# Altium project A3010_Adelaide_8MB_IDE.PrjPcb
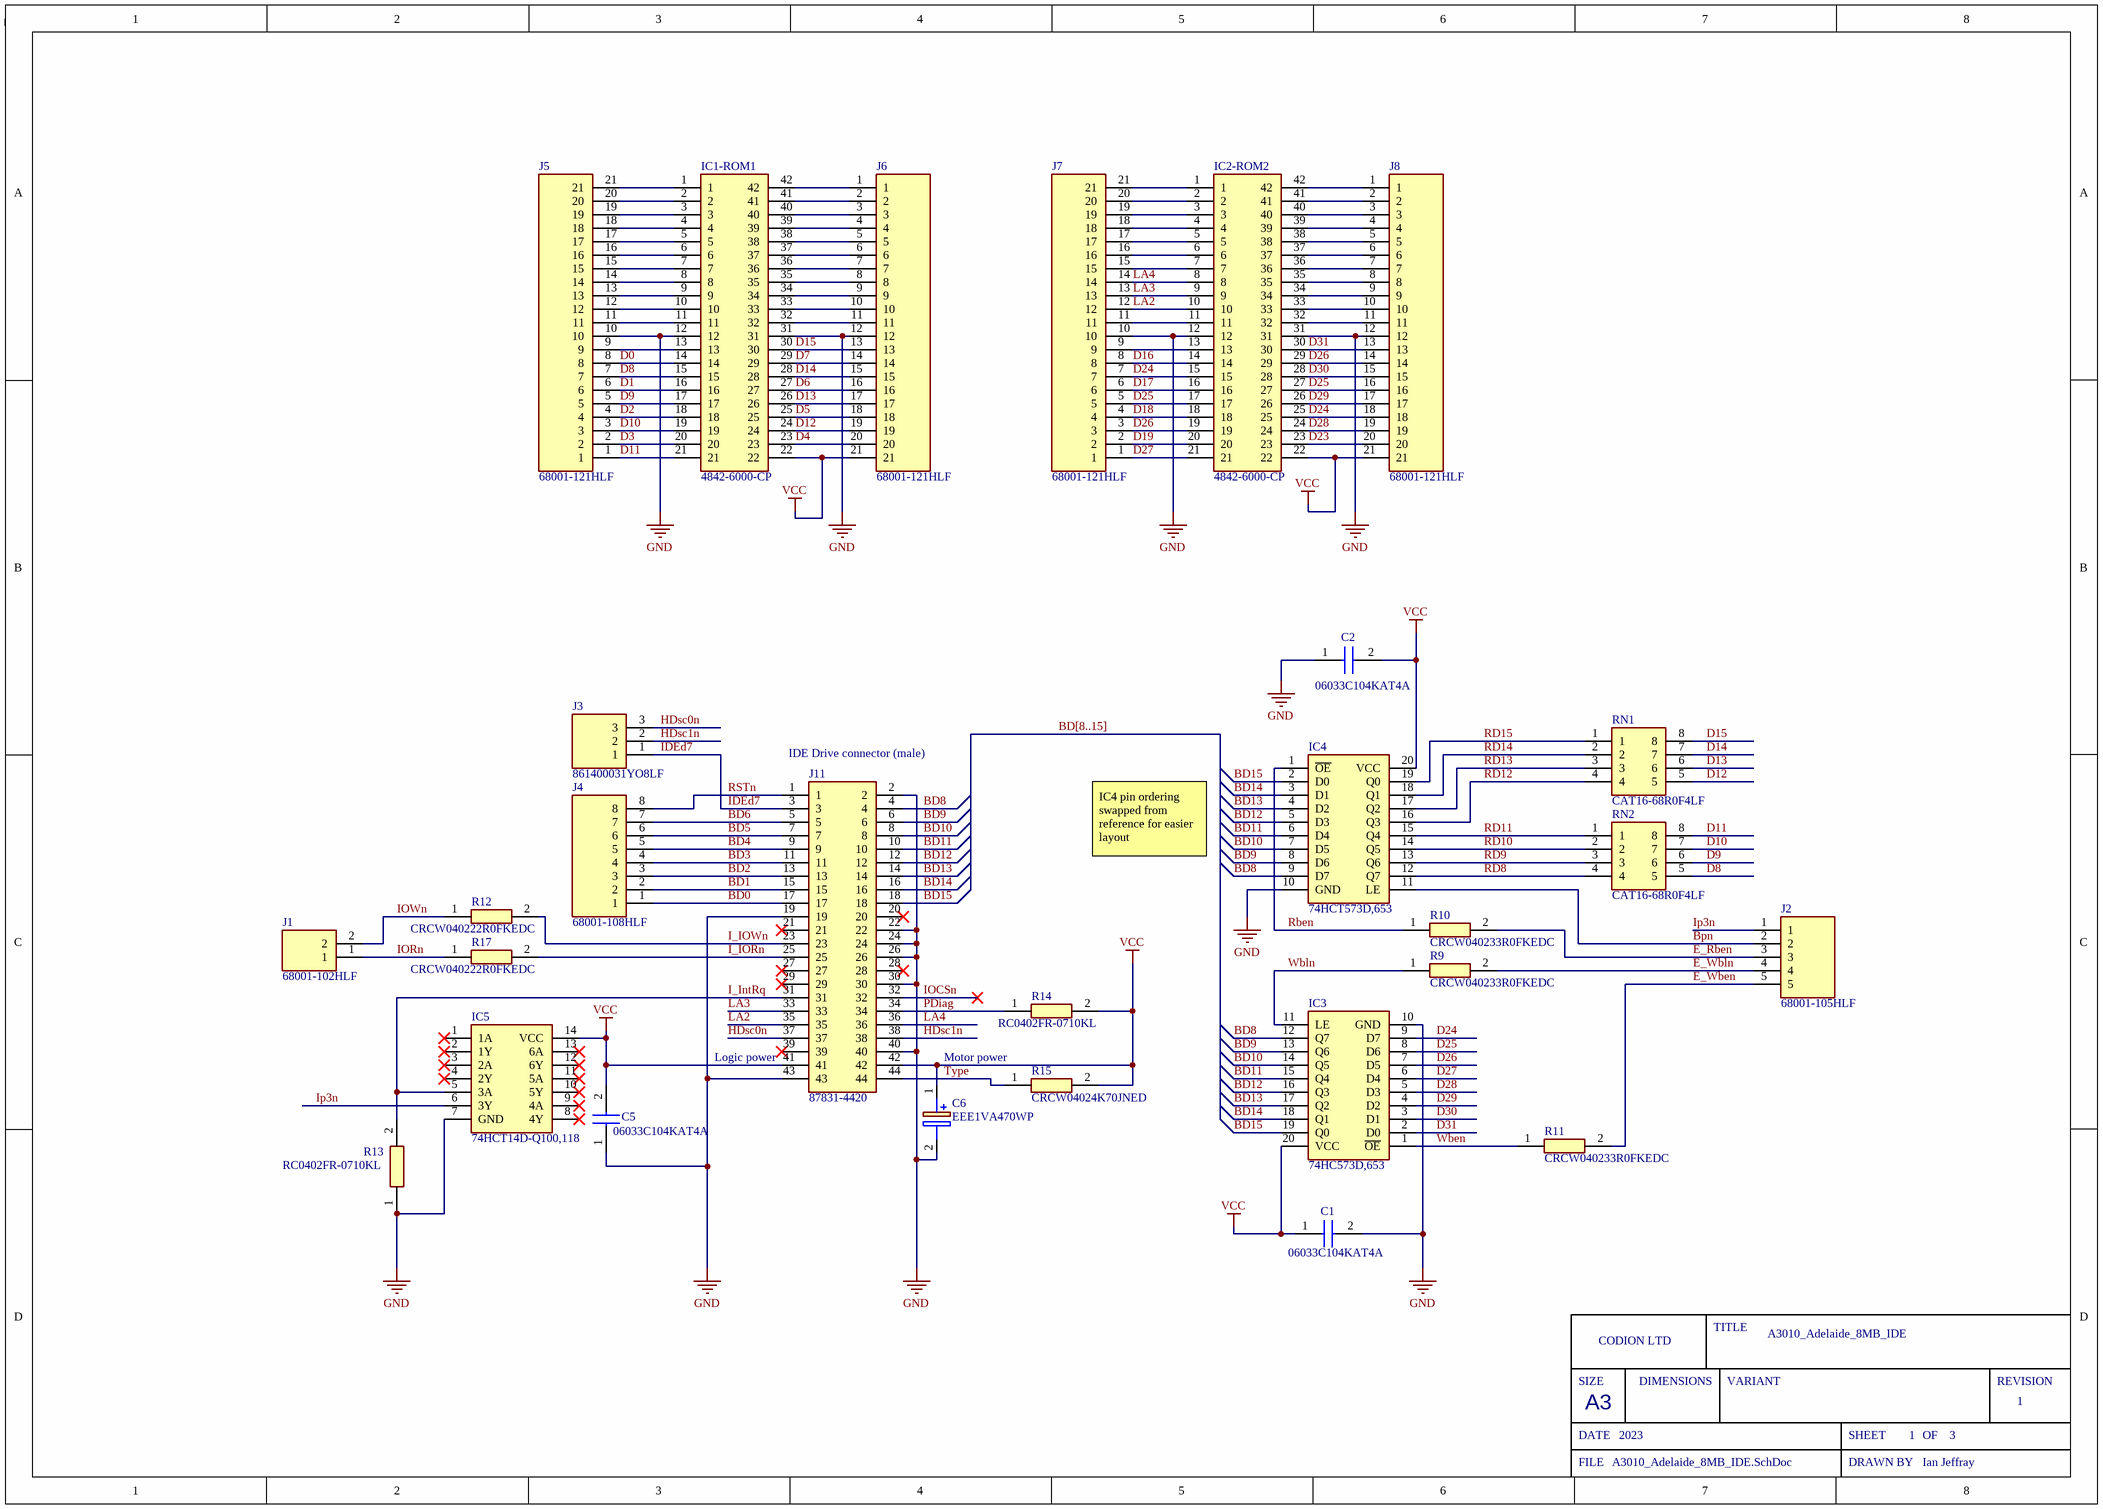
[diagram p0: A3010_Adelaide_8MB_IDE.SchDoc]
Sch_RevNo: 1; Sch_ReleaseDate: 2023; Project_TItle: A3010_Adelaide_8MB_IDE
3 sheets, 57 parts. Net scope: global (net labels, ports and power ports of the same name join across sheets).
Board file: A3010_Adelaide_8MB_IDE.PcbDoc
Sheets:
  A3010_Adelaide_8MB_IDE.SchDoc
  A3010_Adelaide_8MB_IDE_RAM.SchDoc
  A3010_Adelaide_8MB_IDE_RAM2.SchDoc

## Sheet A3010_Adelaide_8MB_IDE.SchDoc
size A3; SheetNumber: 1; SheetTotal: 3

### Parts
C1  06033C104KAT4A  [CAPC1608X90N]
C2  06033C104KAT4A  [CAPC1608X90N]
C5  06033C104KAT4A  [CAPC1608X90N]
C6  EEE1VA470WP  [EEE1AA101SP]
IC1-ROM1  4842-6000-CP  [48426000CP]
IC2-ROM2  4842-6000-CP  [48426000CP]
IC3  74HC573D,653  [SOIC127P1032X265-20N]
IC4  74HCT573D,653  [SOIC127P1032X265-20N]
IC5  74HCT14D-Q100,118  [SOIC127P600X175-14N]
J1  68001-102HLF  [HDRV2W67P0X254_1X2_508X241X858P]
J2  68001-105HLF  [HDRV5W90P0X254_1X5_1270X241X1143P]
J3  861400031YO8LF  [HDRV3W63P0X254_1X3_762X254X980P]
J4  68001-108HLF  [HDRV8W90P0X254_1X8_2032X241X1143P]
J5  68001-121HLF  [HDRV21W67P0X254_1X21_5334X241X858P]
J6  68001-121HLF  [HDRV21W67P0X254_1X21_5334X241X858P]
J7  68001-121HLF  [HDRV21W67P0X254_1X21_5334X241X858P]
J8  68001-121HLF  [HDRV21W67P0X254_1X21_5334X241X858P]
J11  87831-4420  [SHDR44W55P200_2X22_4665X630X640P]
R9  CRCW040233R0FKEDC  [RESC1005X35N]
R10  CRCW040233R0FKEDC  [RESC1005X35N]
R11  CRCW040233R0FKEDC  [RESC1005X35N]
R12  CRCW040222R0FKEDC  [RESC1005X35N]
R13  RC0402FR-0710KL  [RESC1005X40N]
R14  RC0402FR-0710KL  [RESC1005X40N]
R15  CRCW04024K70JNED  [RESC1005X40N]
R17  CRCW040222R0FKEDC  [RESC1005X35N]
RN1  CAT16-68R0F4LF  [CAT1668R0F4LF]
RN2  CAT16-68R0F4LF  [CAT1668R0F4LF]

### Nets
GND: C1.2 C2.1 C5.1 C6.2(-) IC1-ROM1.12 IC1-ROM1.31 IC2-ROM2.12 IC2-ROM2.31 IC3.10(GND) IC4.10(GND) IC5.7(GND) J5.10 J6.12 J7.10 J8.12 J11.2 J11.19 J11.22 J11.24 J11.26 J11.30 J11.40 J11.43 R13.1
VCC: C1.1 C2.2 C5.2 C6.1(+) IC1-ROM1.22 IC2-ROM2.22 IC3.20(VCC) IC4.20(VCC) IC5.14(VCC) J6.21 J8.21 J11.41 J11.42 R14.2 R15.2
BD0: J4.1 J11.17
BD1: J4.2 J11.15
BD2: J4.3 J11.13
BD3: J4.4 J11.11
BD4: J4.5 J11.9
BD5: J4.6 J11.7
BD6: J4.7 J11.5
BD8: IC3.12(Q7) IC4.9(D7) J11.4
BD9: IC3.13(Q6) IC4.8(D6) J11.6
BD10: IC3.14(Q5) IC4.7(D5) J11.8
BD11: IC3.15(Q4) IC4.6(D4) J11.10
BD12: IC3.16(Q3) IC4.5(D3) J11.12
BD13: IC3.17(Q2) IC4.4(D2) J11.14
BD14: IC3.18(Q1) IC4.3(D1) J11.16
BD15: IC3.19(Q0) IC4.2(D0) J11.18
Bpn: IC4.11(LE) J2.2
D0: IC1-ROM1.14 J5.8
D1: IC1-ROM1.16 J5.6
D2: IC1-ROM1.18 J5.4
D3: IC1-ROM1.20 J5.2
D4: IC1-ROM1.23 J6.20
D5: IC1-ROM1.25 J6.18
D6: IC1-ROM1.27 J6.16
D7: IC1-ROM1.29 J6.14
D8: IC1-ROM1.15 J5.7 RN2.5
D9: IC1-ROM1.17 J5.5 RN2.6
D10: IC1-ROM1.19 J5.3 RN2.7
D11: IC1-ROM1.21 J5.1 RN2.8
D12: IC1-ROM1.24 J6.19 RN1.5
D13: IC1-ROM1.26 J6.17 RN1.6
D14: IC1-ROM1.28 J6.15 RN1.7
D15: IC1-ROM1.30 J6.13 RN1.8
D16: IC2-ROM2.14 J7.8
D17: IC2-ROM2.16 J7.6
D18: IC2-ROM2.18 J7.4
D19: IC2-ROM2.20 J7.2
D23: IC2-ROM2.23 J8.20
D24: IC2-ROM2.15 IC2-ROM2.25 IC3.9(D7) J7.7 J8.18
D25: IC2-ROM2.17 IC2-ROM2.27 IC3.8(D6) J7.5 J8.16
D26: IC2-ROM2.19 IC2-ROM2.29 IC3.7(D5) J7.3 J8.14
D27: IC2-ROM2.21 IC3.6(D4) J7.1
D28: IC2-ROM2.24 IC3.5(D3) J8.19
D29: IC2-ROM2.26 IC3.4(D2) J8.17
D30: IC2-ROM2.28 IC3.3(D1) J8.15
D31: IC2-ROM2.30 IC3.2(D0) J8.13
E_Rben: J2.3 R10.2
E_Wben: J2.5 R11.2
E_Wbln: J2.4 R9.2
HDsc0n: J3.3 J11.37
HDsc1n: J3.2 J11.38
I_IntRq: IC5.5(3A) J11.31 R13.2
I_IORn: J11.25 R17.2
I_IOWn: J11.23 R12.2
IDEd7: J3.1 J11.3
IOCSn: J11.32
IORn: J1.1 R17.1
IOWn: J1.2 R12.1
Ip3n: IC5.6(3Y) J2.1
LA2: IC2-ROM2.10 J7.12 J11.35
LA3: IC2-ROM2.9 J7.13 J11.33
LA4: IC2-ROM2.8 J7.14 J11.36
PDiag: J11.34 R14.1
Rben: IC4.1(~{OE}) R10.1
RD8: IC4.12(Q7) RN2.4
RD9: IC4.13(Q6) RN2.3
RD10: IC4.14(Q5) RN2.2
RD11: IC4.15(Q4) RN2.1
RD12: IC4.16(Q3) RN1.4
RD13: IC4.17(Q2) RN1.3
RD14: IC4.18(Q1) RN1.2
RD15: IC4.19(Q0) RN1.1
RSTn: J4.8 J11.1
Type: J11.44 R15.1
Wben: IC3.1(~{OE}) R11.1
Wbln: IC3.11(LE) R9.1
NetIC1-ROM1_1: IC1-ROM1.1 J5.21
NetIC1-ROM1_2: IC1-ROM1.2 J5.20
NetIC1-ROM1_3: IC1-ROM1.3 J5.19
NetIC1-ROM1_4: IC1-ROM1.4 J5.18
NetIC1-ROM1_5: IC1-ROM1.5 J5.17
NetIC1-ROM1_6: IC1-ROM1.6 J5.16
NetIC1-ROM1_7: IC1-ROM1.7 J5.15
NetIC1-ROM1_8: IC1-ROM1.8 J5.14
NetIC1-ROM1_9: IC1-ROM1.9 J5.13
NetIC1-ROM1_10: IC1-ROM1.10 J5.12
NetIC1-ROM1_11: IC1-ROM1.11 J5.11
NetIC1-ROM1_13: IC1-ROM1.13 J5.9
NetIC1-ROM1_32: IC1-ROM1.32 J6.11
NetIC1-ROM1_33: IC1-ROM1.33 J6.10
NetIC1-ROM1_34: IC1-ROM1.34 J6.9
NetIC1-ROM1_35: IC1-ROM1.35 J6.8
NetIC1-ROM1_36: IC1-ROM1.36 J6.7
NetIC1-ROM1_37: IC1-ROM1.37 J6.6
NetIC1-ROM1_38: IC1-ROM1.38 J6.5
NetIC1-ROM1_39: IC1-ROM1.39 J6.4
NetIC1-ROM1_40: IC1-ROM1.40 J6.3
NetIC1-ROM1_41: IC1-ROM1.41 J6.2
NetIC1-ROM1_42: IC1-ROM1.42 J6.1
NetIC2-ROM2_1: IC2-ROM2.1 J7.21
NetIC2-ROM2_2: IC2-ROM2.2 J7.20
NetIC2-ROM2_3: IC2-ROM2.3 J7.19
NetIC2-ROM2_4: IC2-ROM2.4 J7.18
NetIC2-ROM2_5: IC2-ROM2.5 J7.17
NetIC2-ROM2_6: IC2-ROM2.6 J7.16
NetIC2-ROM2_7: IC2-ROM2.7 J7.15
NetIC2-ROM2_11: IC2-ROM2.11 J7.11
NetIC2-ROM2_13: IC2-ROM2.13 J7.9
NetIC2-ROM2_32: IC2-ROM2.32 J8.11
NetIC2-ROM2_33: IC2-ROM2.33 J8.10
NetIC2-ROM2_34: IC2-ROM2.34 J8.9
NetIC2-ROM2_35: IC2-ROM2.35 J8.8
NetIC2-ROM2_36: IC2-ROM2.36 J8.7
NetIC2-ROM2_37: IC2-ROM2.37 J8.6
NetIC2-ROM2_38: IC2-ROM2.38 J8.5
NetIC2-ROM2_39: IC2-ROM2.39 J8.4
NetIC2-ROM2_40: IC2-ROM2.40 J8.3
NetIC2-ROM2_41: IC2-ROM2.41 J8.2
NetIC2-ROM2_42: IC2-ROM2.42 J8.1

Not connected (* = marked no-connect by the designer): IC5 1(1A)* 2(1Y)* 3(2A)* 4(2Y)* 8(4Y)* 9(4A)* 10(5Y)* 11(5A)* 12(6Y)* 13(6A)*; J11 20* 21* 27* 28* 29* 39*

### Buses and harness runs
bus BD[8..15]

### Notes on the sheet
- (near J11) IDE Drive connector (male)
- IC4 pin ordering swapped from reference for easier layout
- (near J11) Logic power
- Motor power
- Ian Jeffray
- SIZE
- CODION LTD
- DIMENSIONS
- TITLE
- VARIANT
- REVISION
- DATE
- A3
- SHEET
- OF
- FILE
- DRAWN BY

### Library data of the parts
C1 C2 C5 = 06033C104KAT4A: Capacitor; Manufacturer_Name: AVX; Datasheet Link: http://www.mouser.com/catalog/supplier/library/pdf/AVXSurfaceMountCeramic.pdf; Height: 0.9mm; Manufacturer_Part_Number: 06033C104KAT4A; Mouser Part Number: 581-06033C104KAT4A; Mouser Price/Stock: https://www.mouser.co.uk/ProductDetail/AVX/06033C104KAT4A?qs=8C2chATdSPiv3E9zfPZulg%3D%3D; Arrow Part Number: 06033C104KAT4A; Arrow Price/Stock: https://www.arrow.com/en/products/06033c104kat4a/avx?region=nac
C6 = EEE1VA470WP: Capacitor Polarised; Manufacturer_Name: Panasonic; Datasheet Link: http://industrial.panasonic.com/cdbs/www-data/pdf/RDE0000/ABA0000C1145.pdf; Height: 7.8mm; Manufacturer_Part_Number: EEE1VA470WP
IC1-ROM1 IC2-ROM2 = 4842-6000-CP: Connector; Manufacturer_Name: 3M; Datasheet Link: https://componentsearchengine.com/Datasheets/1/4842-6000-CP.pdf; Height: 5.334mm; Manufacturer_Part_Number: 4842-6000-CP; Mouser Part Number: 517-4842-6000-CP; Mouser Price/Stock: https://www.mouser.com/Search/Refine.aspx?Keyword=517-4842-6000-CP
IC3 = 74HC573D,653: Integrated Circuit; Manufacturer_Name: Nexperia; Datasheet Link: https://assets.nexperia.com/documents/data-sheet/74HC_HCT573.pdf; Height: 2.65mm; Manufacturer_Part_Number: 74HC573D,653; Mouser Part Number: 771-74HC573D-T; Mouser Price/Stock: https://www.mouser.co.uk/ProductDetail/Nexperia/74HC573D653?qs=P62ublwmbi8WfKX2wZR8SA%3D%3D; Arrow Part Number: 74HC573D,653; Arrow Price/Stock: https://www.arrow.com/en/products/74hc573d653/nexperia?region=asia
IC4 = 74HCT573D,653: Integrated Circuit; Manufacturer_Name: Nexperia; Datasheet Link: https://assets.nexperia.com/documents/data-sheet/74HC_HCT573.pdf; Height: 2.65mm; Manufacturer_Part_Number: 74HCT573D,653; Mouser Part Number: 771-HCT573D653; Mouser Price/Stock: https://www.mouser.co.uk/ProductDetail/Nexperia/74HCT573D653?qs=me8TqzrmIYW0cewPmm%252By%2Fg%3D%3D; Arrow Part Number: 74HCT573D,653; Arrow Price/Stock: https://www.arrow.com/en/products/74hct573d653/nexperia
IC5 = 74HCT14D-Q100,118: Integrated Circuit; Manufacturer_Name: Nexperia; Datasheet Link: https://assets.nexperia.com/documents/data-sheet/74HC_HCT14_Q100.pdf; Height: 1.75mm; Manufacturer_Part_Number: 74HCT14D-Q100,118; Mouser Part Number: 771-74HCT14D-Q100118; Mouser Price/Stock: https://www.mouser.com/Search/Refine.aspx?Keyword=771-74HCT14D-Q100118; Arrow Part Number: 74HCT14D-Q100,118; Arrow Price/Stock: https://www.arrow.com/en/products/74hct14d-q100118/nexperia?region=nac
J1 = 68001-102HLF: Connector; Manufacturer_Name: Amphenol; Datasheet Link: https://cdn.amphenol-icc.com/media/wysiwyg/files/drawing/68000.pdf; Height: 8.58mm; Manufacturer_Part_Number: 68001-102HLF; Mouser Part Number: 649-68001-102HLF; Mouser Price/Stock: https://www.mouser.co.uk/ProductDetail/Amphenol-FCI/68001-102HLF/?qs=U4OZ2mbKj8feu9tJlaXIaQ%3D%3D; Arrow Part Number: 68001-102HLF; Arrow Price/Stock: https://www.arrow.com/en/products/68001-102hlf/amphenol-fci
J2 = 68001-105HLF: Connector; Manufacturer_Name: Amphenol; Datasheet Link: https://datasheet.datasheetarchive.com/originals/distributors/Datasheets_SAMA/c5633c0073cf34d35a9dcd840869dfda.pdf; Height: 11.43mm; Manufacturer_Part_Number: 68001-105HLF; Mouser Part Number: 649-68001-105HLF; Mouser Price/Stock: https://www.mouser.com/Search/Refine.aspx?Keyword=649-68001-105HLF; Arrow Part Number: 68001-105HLF; Arrow Price/Stock: https://www.arrow.com/en/products/68001-105hlf/amphenol-fci
J3 = 861400031YO8LF: Connector; Manufacturer_Name: Amphenol; Datasheet Link: https://cdn.amphenol-icc.com/media/wysiwyg/files/drawing/c-8614-0089.pdf; Height: 9.8mm; Manufacturer_Part_Number: 861400031YO8LF; Mouser Part Number: 649-861400031YO8LF; Mouser Price/Stock: https://www.mouser.com/Search/Refine.aspx?Keyword=649-861400031YO8LF; Arrow Part Number: 861400031YO8LF; Arrow Price/Stock: https://www.arrow.com/en/products/861400031yo8lf/amphenol-fci
J4 = 68001-108HLF: Connector; Manufacturer_Name: Amphenol; Datasheet Link: https://datasheet.datasheetarchive.com/originals/distributors/Datasheets_SAMA/c5633c0073cf34d35a9dcd840869dfda.pdf; Height: 11.43mm; Manufacturer_Part_Number: 68001-108HLF; Mouser Part Number: 649-68001-108HLF; Mouser Price/Stock: https://www.mouser.co.uk/ProductDetail/Amphenol-FCI/68001-108HLF?qs=QKvFUfBIyQKXzKR4Fn7cFQ%3D%3D; Arrow Part Number: 68001-108HLF; Arrow Price/Stock: https://www.arrow.com/en/products/68001-108hlf/amphenol-fci?region=nac
J5-J8 = 68001-121HLF: Connector; Manufacturer_Name: Amphenol; Datasheet Link: https://datasheet.datasheetarchive.com/originals/distributors/Datasheets_SAMA/c5633c0073cf34d35a9dcd840869dfda.pdf; Height: 8.58mm; Manufacturer_Part_Number: 68001-121HLF; Mouser Part Number: 649-68001-121HLF; Mouser Price/Stock: https://www.mouser.co.uk/ProductDetail/Amphenol-FCI/68001-121HLF/?qs=QKvFUfBIyQK%252BoxmWjqVzjQ%3D%3D; Arrow Part Number: 68001-121HLF; Arrow Price/Stock: https://www.arrow.com/en/products/68001-121hlf/amphenol-fci?region=nac
J11 = 87831-4420: Connector; Manufacturer_Name: Molex; Datasheet Link: https://datasheet.datasheetarchive.com/originals/distributors/Datasheets-DGA22/2095109.pdf; Height: 6.4mm; Manufacturer_Part_Number: 87831-4420; Mouser Part Number: 538-87831-4420; Mouser Price/Stock: https://www.mouser.co.uk/ProductDetail/Molex/87831-4420?qs=tYx%252BZc2nXqqGnHzye8Wn9w%3D%3D
R9-R11 = CRCW040233R0FKEDC: Resistor; Manufacturer_Name: Vishay; Datasheet Link: http://www.vishay.com/docs/28773/crcwce3.pdf; Height: 0.35mm; Manufacturer_Part_Number: CRCW040233R0FKEDC; Mouser Part Number: 71-CRCW040233R0FKEDC; Mouser Price/Stock: https://www.mouser.co.uk/ProductDetail/Vishay-Dale/CRCW040233R0FKEDC?qs=E3Y5ESvWgWMDHctUwHh1hg%3D%3D; Arrow Part Number: CRCW040233R0FKEDC; Arrow Price/Stock: https://www.arrow.com/en/products/crcw040233r0fkedc/vishay?region=nac
R12 R17 = CRCW040222R0FKEDC: Resistor; Manufacturer_Name: Vishay; Datasheet Link: http://www.vishay.com/docs/28773/crcwce3.pdf; Height: 0.35mm; Manufacturer_Part_Number: CRCW040222R0FKEDC; Mouser Part Number: 71-CRCW040222R0FKEDC; Mouser Price/Stock: https://www.mouser.co.uk/ProductDetail/Vishay-Dale/CRCW040222R0FKEDC?qs=E3Y5ESvWgWOcWdklyAJ7%252BQ%3D%3D; Arrow Part Number: CRCW040222R0FKEDC; Arrow Price/Stock: https://www.arrow.com/en/products/crcw040222r0fkedc/vishay?region=nac
R13 R14 = RC0402FR-0710KL: Resistor; Manufacturer_Name: YAGEO (PHYCOMP); Datasheet Link: https://datasheet.datasheetarchive.com/originals/distributors/Datasheets_SAMA/902f9e387b938f871d31120f5fc1d65e.pdf; Height: 0.4mm; Manufacturer_Part_Number: RC0402FR-0710KL; Mouser Part Number: 603-RC0402FR-0710KL; Mouser Price/Stock: https://www.mouser.co.uk/ProductDetail/YAGEO/RC0402FR-0710KL?qs=I1mnnYJTTsxUoNwrUsQExA%3D%3D; Arrow Part Number: RC0402FR-0710KL; Arrow Price/Stock: https://www.arrow.com/en/products/rc0402fr-0710kl/yageo
R15 = CRCW04024K70JNED: Resistor; Manufacturer_Name: Vishay; Datasheet Link: http://www.vishay.com/docs/20035/dcrcwe3.pdf; Height: 0.4mm; Manufacturer_Part_Number: CRCW04024K70JNED; Mouser Part Number: 71-CRCW0402J-4.7K-E3; Mouser Price/Stock: https://www.mouser.co.uk/ProductDetail/Vishay-Dale/CRCW04024K70JNED?qs=iWCWVRvNViwY%252BotGHUbALg%3D%3D; Arrow Part Number: CRCW04024K70JNED; Arrow Price/Stock: https://www.arrow.com/en/products/crcw04024k70jned/vishay
RN1 RN2 = CAT16-68R0F4LF: Resistor Network; Manufacturer_Name: Bourns; Datasheet Link: https://www.mouser.com/datasheet/2/54/CATCAY-777361.pdf; Height: 0.6mm; Manufacturer_Part_Number: CAT16-68R0F4LF; Mouser Part Number: 652-CAT16-68R0F4LF; Mouser Price/Stock: https://www.mouser.co.uk/ProductDetail/Bourns/CAT16-68R0F4LF?qs=2cU%252Bdy8NdRpfh4EnG7Hj3A%3D%3D

## Sheet A3010_Adelaide_8MB_IDE_RAM.SchDoc
size A3; SheetNumber: 2; SheetTotal: 3
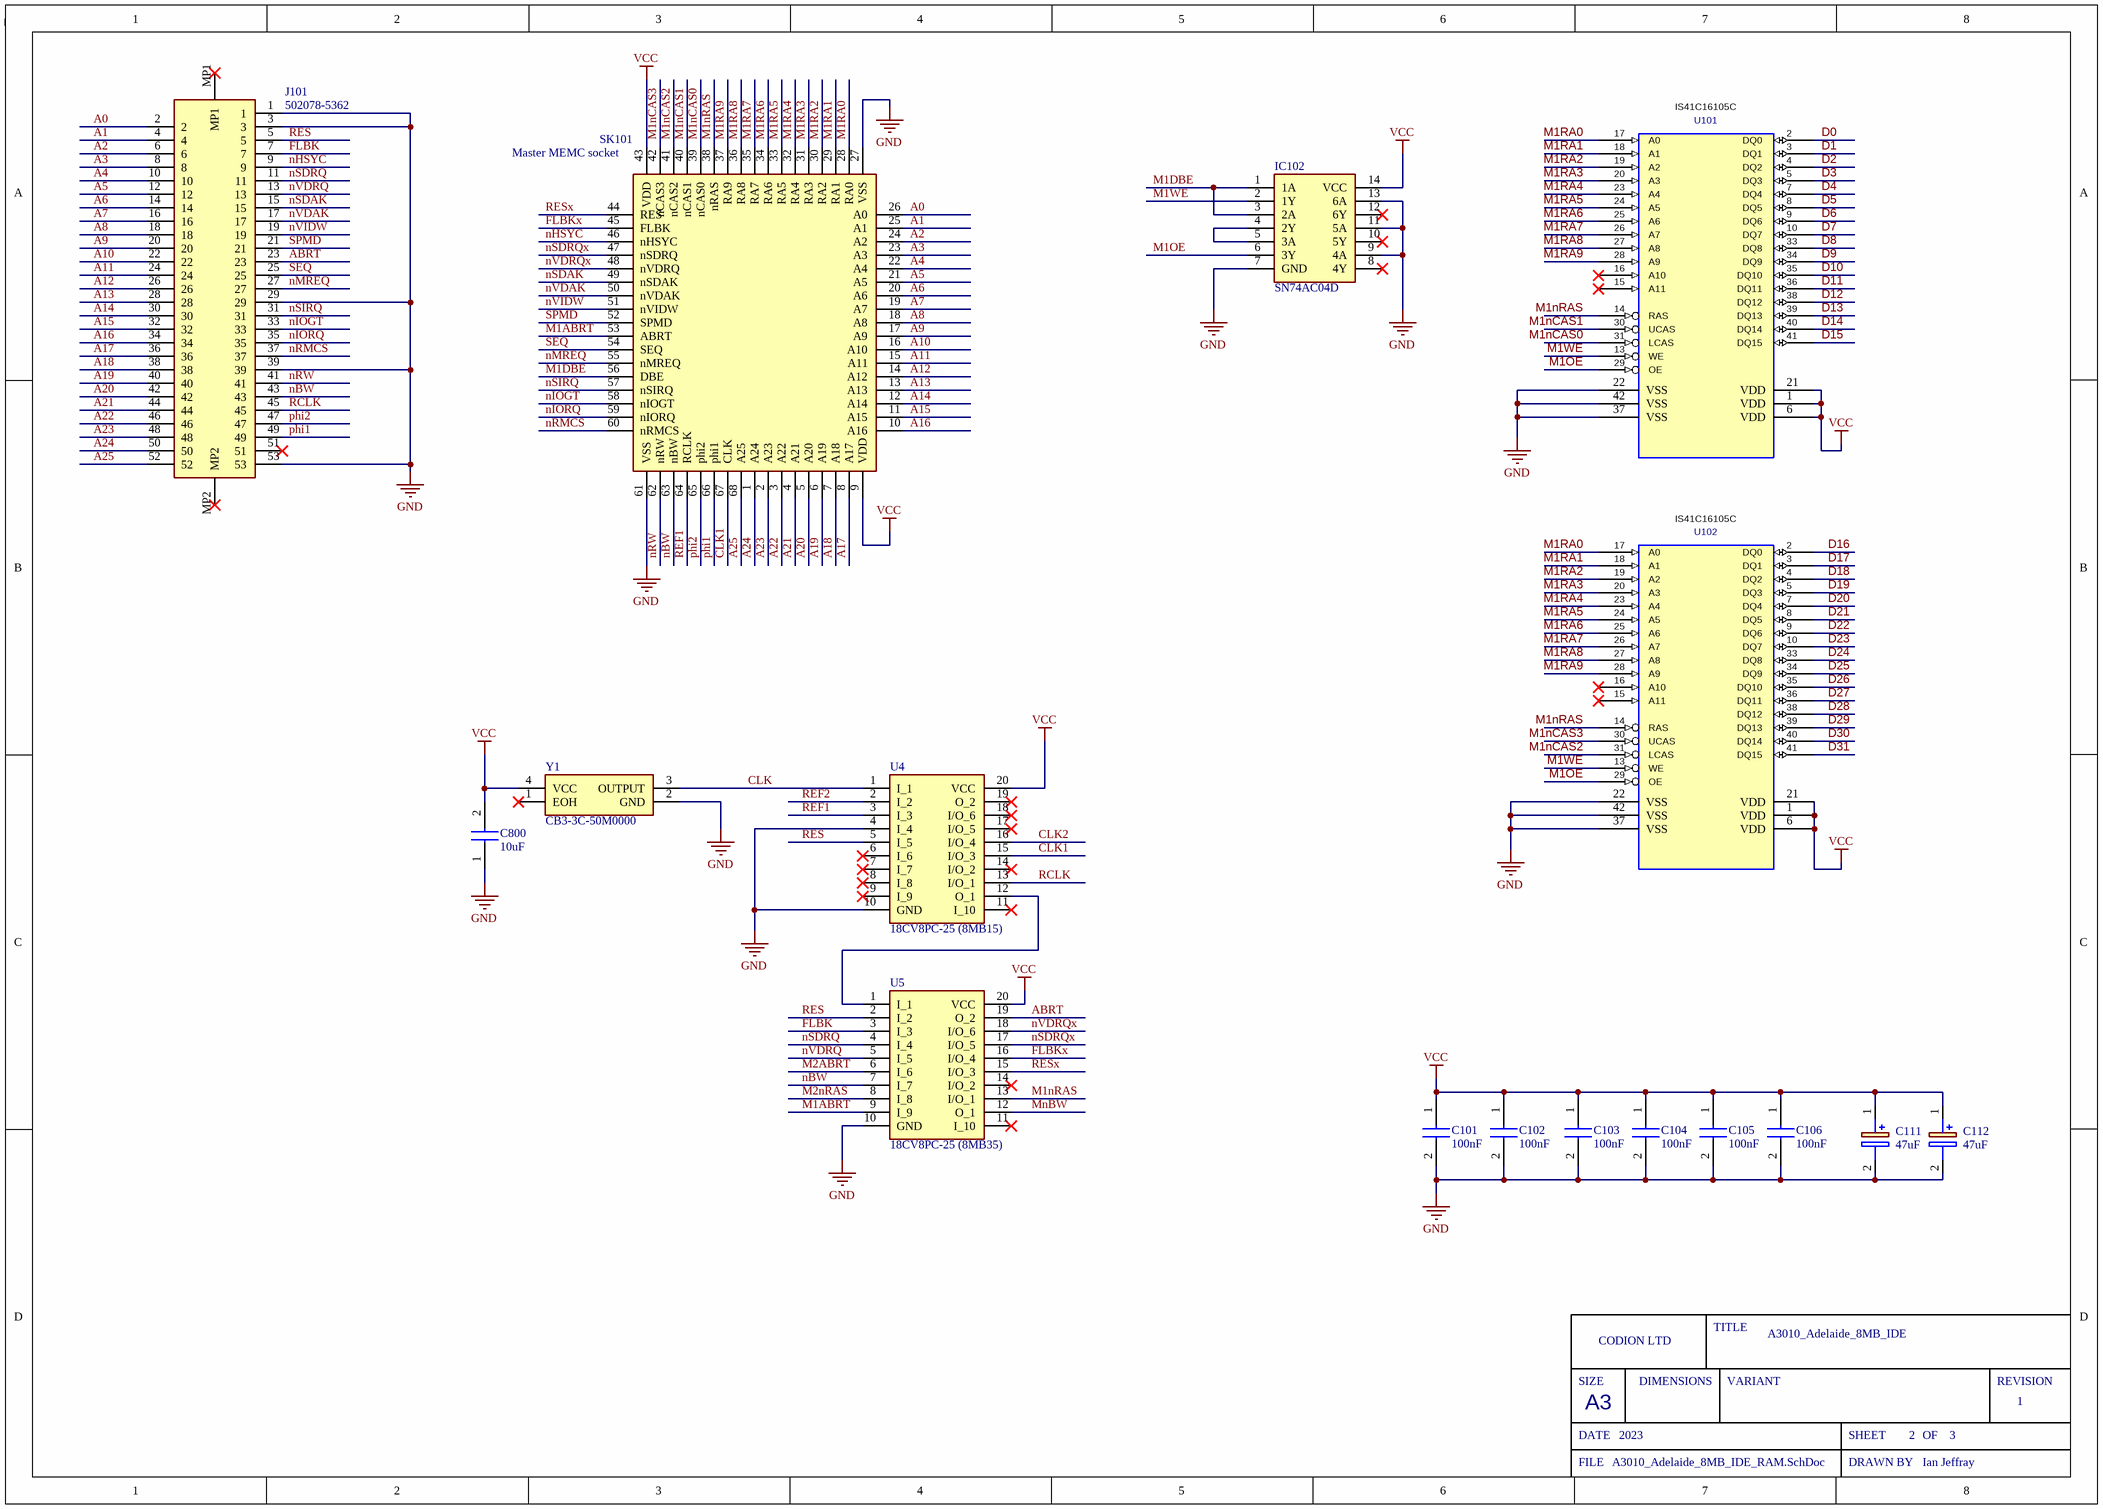
[diagram p1: A3010_Adelaide_8MB_IDE_RAM.SchDoc]

### Parts
C101  100nF  [CAPC2012X145N]
C102  100nF  [CAPC2012X145N]
C103  100nF  [CAPC2012X145N]
C104  100nF  [CAPC2012X145N]
C105  100nF  [CAPC2012X145N]
C106  100nF  [CAPC2012X145N]
C111  47uF  [EEE1AA101SP]
C112  47uF  [EEE1AA101SP]
C800  10uF  [CAPC1005X55N]
IC102  SN74AC04D  [SOIC127P600X175-14N]
J101  502078-5362  [5020785362]
SK101  Master MEMC socket  [MEMC_Socket]
U4  18CV8PC-25 (8MB15)  [DIP762W66P254L2692H508Q20N]
U5  18CV8PC-25 (8MB35)  [DIP762W66P254L2692H508Q20N]
U101  IS41C16105C  [SOJ-42]
U102  IS41C16105C  [SOJ-42]
Y1  CB3-3C-50M0000  [CB33C50M0000]

### Nets
GND: C101.2 C102.2 C103.2 C104.2 C105.2 C106.2 C111.2(-) C112.2(-) C800.1 IC102.7(GND) IC102.9(4A) IC102.11(5A) IC102.13(6A) J101.1 J101.3 J101.29 J101.39 J101.53 SK101.27(VSS) SK101.61(VSS) U4.4(I_4) U4.10(GND) U5.10(GND) U101.22(VSS) U101.37(VSS) U101.42(VSS) U102.22(VSS) U102.37(VSS) U102.42(VSS) Y1.2(GND)
VCC: C101.1 C102.1 C103.1 C104.1 C105.1 C106.1 C111.1(+) C112.1(+) C800.2 IC102.14(VCC) SK101.9(VDD) SK101.43(VDD) U4.20(VCC) U5.20(VCC) U101.1(VCC) U101.6(VCC) U101.21(VCC) U102.1(VCC) U102.6(VCC) U102.21(VCC) Y1.4(VCC)
A0: J101.2 SK101.26(A0)
A1: J101.4 SK101.25(A1)
A2: J101.6 SK101.24(A2)
A3: J101.8 SK101.23(A3)
A4: J101.10 SK101.22(A4)
A5: J101.12 SK101.21(A5)
A6: J101.14 SK101.20(A6)
A7: J101.16 SK101.19(A7)
A8: J101.18 SK101.18(A8)
A9: J101.20 SK101.17(A9)
A10: J101.22 SK101.16(A10)
A11: J101.24 SK101.15(A11)
A12: J101.26 SK101.14(A12)
A13: J101.28 SK101.13(A13)
A14: J101.30 SK101.12(A14)
A15: J101.32 SK101.11(A15)
A16: J101.34 SK101.10(A16)
A17: J101.36 SK101.8(A17)
A18: J101.38 SK101.7(A18)
A19: J101.40 SK101.6(A19)
A20: J101.42 SK101.5(A20)
A21: J101.44 SK101.4(A21)
A22: J101.46 SK101.3(A22)
A23: J101.48 SK101.2(A23)
A24: J101.50 SK101.1(A24)
A25: J101.52 SK101.68(A25)
ABRT: J101.23 U5.19(O_2)
CLK: U4.1(I_1) Y1.3(OUTPUT)
CLK1: SK101.67(CLK) U4.15(I/O_3)
CLK2: U4.16(I/O_4)
D0: U101.2(DQ0)
D1: U101.3(DQ1)
D2: U101.4(DQ2)
D3: U101.5(DQ3)
D4: U101.7(DQ4)
D5: U101.8(DQ5)
D6: U101.9(DQ6)
D7: U101.10(DQ7)
D8: U101.33(DQ8)
D9: U101.34(DQ9)
D10: U101.35(DQ10)
D11: U101.36(DQ11)
D12: U101.38(DQ12)
D13: U101.39(DQ13)
D14: U101.40(DQ14)
D15: U101.41(DQ15)
D16: U102.2(DQ0)
D17: U102.3(DQ1)
D18: U102.4(DQ2)
D19: U102.5(DQ3)
D20: U102.7(DQ4)
D21: U102.8(DQ5)
D22: U102.9(DQ6)
D23: U102.10(DQ7)
D24: U102.33(DQ8)
D25: U102.34(DQ9)
D26: U102.35(DQ10)
D27: U102.36(DQ11)
D28: U102.38(DQ12)
D29: U102.39(DQ13)
D30: U102.40(DQ14)
D31: U102.41(DQ15)
FLBK: J101.7 U5.3(I_3)
FLBKx: SK101.45(FLBK) U5.16(I/O_4)
M1ABRT: SK101.53(ABRT) U5.9(I_9)
M1DBE: IC102.1(1A) IC102.3(2A) SK101.56(DBE)
M1nCAS0: SK101.39(nCAS0) U101.31(LCAS)
M1nCAS1: SK101.40(nCAS1) U101.30(UCAS)
M1nCAS2: SK101.41(nCAS2) U102.31(LCAS)
M1nCAS3: SK101.42(nCAS3) U102.30(UCAS)
M1nRAS: SK101.38(nRAS) U5.13(I/O_1) U101.14(RAS) U102.14(RAS)
M1OE: IC102.6(3Y) U101.29(OE) U102.29(OE)
M1RA0: SK101.28(RA0) U101.17(A0) U102.17(A0)
M1RA1: SK101.29(RA1) U101.18(A1) U102.18(A1)
M1RA2: SK101.30(RA2) U101.19(A2) U102.19(A2)
M1RA3: SK101.31(RA3) U101.20(A3) U102.20(A3)
M1RA4: SK101.32(RA4) U101.23(A4) U102.23(A4)
M1RA5: SK101.33(RA5) U101.24(A5) U102.24(A5)
M1RA6: SK101.34(RA6) U101.25(A6) U102.25(A6)
M1RA7: SK101.35(RA7) U101.26(A7) U102.26(A7)
M1RA8: SK101.36(RA8) U101.27(A8) U102.27(A8)
M1RA9: SK101.37(RA9) U101.28(A9) U102.28(A9)
M1WE: IC102.2(1Y) U101.13(WE) U102.13(WE)
M2ABRT: U5.6(I_6)
M2nRAS: U5.8(I_8)
MnBW: U5.12(O_1)
nBW: J101.43 SK101.63(nBW) U5.7(I_7)
nHSYC: J101.9 SK101.46(nHSYC)
nIOGT: J101.33 SK101.58(nIOGT)
nIORQ: J101.35 SK101.59(nIORQ)
nMREQ: J101.27 SK101.55(nMREQ)
nRMCS: J101.37 SK101.60(nRMCS)
nRW: J101.41 SK101.62(nRW)
nSDAK: J101.15 SK101.49(nSDAK)
nSDRQ: J101.11 U5.4(I_4)
nSDRQx: SK101.47(nSDRQ) U5.17(I/O_5)
nSIRQ: J101.31 SK101.57(nSIRQ)
nVDAK: J101.17 SK101.50(nVDAK)
nVDRQ: J101.13 U5.5(I_5)
nVDRQx: SK101.48(nVDRQ) U5.18(I/O_6)
nVIDW: J101.19 SK101.51(nVIDW)
phi1: J101.49 SK101.66(phi1)
phi2: J101.47 SK101.65(phi2)
RCLK: J101.45 U4.13(I/O_1)
REF1: SK101.64(RCLK) U4.3(I_3)
REF2: U4.2(I_2)
RES: J101.5 U4.5(I_5) U5.2(I_2)
RESx: SK101.44(RES) U5.15(I/O_3)
SEQ: J101.25 SK101.54(SEQ)
SPMD: J101.21 SK101.52(SPMD)
NetIC102_4: IC102.4(2Y) IC102.5(3A)
NetU4_12: U4.12(O_1) U5.1(I_1)

Not connected (* = marked no-connect by the designer): IC102 8(4Y)* 10(5Y)* 12(6Y)*; J101 51* MP1* MP2*; U4 6(I_6)* 7(I_7)* 8(I_8)* 9(I_9)* 11(I_10)* 14(I/O_2)* 17(I/O_5)* 18(I/O_6)* 19(O_2)*; U5 11(I_10)* 14(I/O_2)*; U101 15(A11)* 16(A10)*; U102 15(A11)* 16(A10)*; Y1 1(EOH)*

### Notes on the sheet
- Ian Jeffray
- SIZE
- CODION LTD
- DIMENSIONS
- TITLE
- VARIANT
- REVISION
- DATE
- A3
- SHEET
- OF
- FILE
- DRAWN BY

### Library data of the parts
C101-C106 = C2012X7R1H104K125AM: Capacitor; Manufacturer_Name: TDK; Datasheet Link: https://product.tdk.com/info/en/catalog/datasheets/mlcc_commercial_midvoltage_en.pdf; Height: 1.45mm; Manufacturer_Part_Number: C2012X7R1H104K125AM; Mouser Part Number: 810-C2012X7R1H104KT5; Mouser Price/Stock: https://www.mouser.com/Search/Refine.aspx?Keyword=810-C2012X7R1H104KT5; Arrow Part Number: C2012X7R1H104K125AM; Arrow Price/Stock: https://www.arrow.com/en/products/c2012x7r1h104k125am/tdk
C111 C112 = EEE1VA470WP: as C6 on sheet A3010_Adelaide_8MB_IDE; Datasheet Link: http://industrial.panasonic.com/cdbs/www-data/pdf/RDE0000/ABA0000C1145.pdf; Height: 7.8mm; Manufacturer_Part_Number: EEE1VA470WP
C800 = GRM155R60E106ME16D: Capacitor; Manufacturer_Name: Murata Electronics; Datasheet Link: http://www.murata.com/~/media/webrenewal/support/library/catalog/products/capacitor/mlcc/c02e.pdf; Height: 0.55mm; Manufacturer_Part_Number: GRM155R60E106ME16D; Mouser Part Number: 81-GRM155R60E106ME6D; Mouser Price/Stock: https://www.mouser.co.uk/ProductDetail/Murata-Electronics/GRM155R60E106ME16D?qs=WjGk7BNrzSEW%252BbCEsPsbOg%3D%3D; Arrow Part Number: GRM155R60E106ME16D; Arrow Price/Stock: https://www.arrow.com/en/products/grm155r60e106me16d/murata-manufacturing
IC102 = SN74AC04D: Integrated Circuit; Manufacturer_Name: Texas Instruments; Datasheet Link: http://www.ti.com/lit/ds/symlink/sn74ac04.pdf; Height: 1.75mm; Manufacturer_Part_Number: SN74AC04D; Mouser Part Number: 595-SN74AC04D; Mouser Price/Stock: https://www.mouser.co.uk/ProductDetail/Texas-Instruments/SN74AC04D?qs=w32V8uFkMxkvsyMHHacuZw%3D%3D; Arrow Part Number: SN74AC04D; Arrow Price/Stock: https://www.arrow.com/en/products/sn74ac04d/texas-instruments?region=nac
J101 = 502078-5362: Connector; Manufacturer_Name: Molex; Datasheet Link: https://componentsearchengine.com/Datasheets/1/502078-5362.pdf; Height: 1.15mm; Manufacturer_Part_Number: 502078-5362; Mouser Part Number: 538-502078-5362; Mouser Price/Stock: https://www.mouser.com/Search/Refine.aspx?Keyword=538-502078-5362
SK101 = MEMC_Skt: MEMC socket; Manufacturer_Name: 3M; Manufacturer_Part_Number: 8468-21B1-RK-TR; Datasheet Link: https://www.arrow.com/en/products/8468-21b1-rk-tr/3m; Height: 4.6mm; Mouser Part Number: 517-8468-21B1-RK-TR; Mouser Price/Stock: https://www.mouser.co.uk/ProductDetail/3M-Electronic-Solutions-Division/8468-21B1-RK-TR?qs=X%2F%2F06fXhnJ18zOj3KK47CQ%3D%3D; Arrow Part Number: 8468-21B1-RK-TR; Arrow Price/Stock: https://www.arrow.com/en/products/8468-21b1-rk-tr/3m
U4 U5 = PAL16R4AMJ: Integrated Circuit; Manufacturer_Name: Texas Instruments; Datasheet Link: http://www.ti.com/lit/ds/symlink/pal16r4am.pdf; Height: 5.08mm; Manufacturer_Part_Number: PAL16R4AMJ; Mouser Part Number: 595-PAL16R4AMJ; Mouser Price/Stock: https://www.mouser.com/Search/Refine.aspx?Keyword=595-PAL16R4AMJ
U101 U102 = DRAM_1MX16_SOJ: Value: IS41C16105C
Y1 = CB3-3C-50M0000: Crystal or Oscillator; Manufacturer_Name: CTS; Datasheet Link: https://www.arrow.com/en/products/cb3-3c-50m0000/cts; Height: 1.8mm; Manufacturer_Part_Number: CB3-3C-50M0000; Mouser Part Number: 774-CB3-3C-50M0; Mouser Price/Stock: https://www.mouser.co.uk/ProductDetail/CTS-Electronic-Components/CB3-3C-50M0000/?qs=HL%252BYNjdyZ0t9%2FwogPxCGyA%3D%3D; Arrow Part Number: CB3-3C-50M0000; Arrow Price/Stock: https://www.arrow.com/en/products/cb3-3c-50m0000/cts

## Sheet A3010_Adelaide_8MB_IDE_RAM2.SchDoc: ARM2 to ARM3 Adapter
size A3; DocumentNumber: 1; SheetNumber: 3; SheetTotal: 3
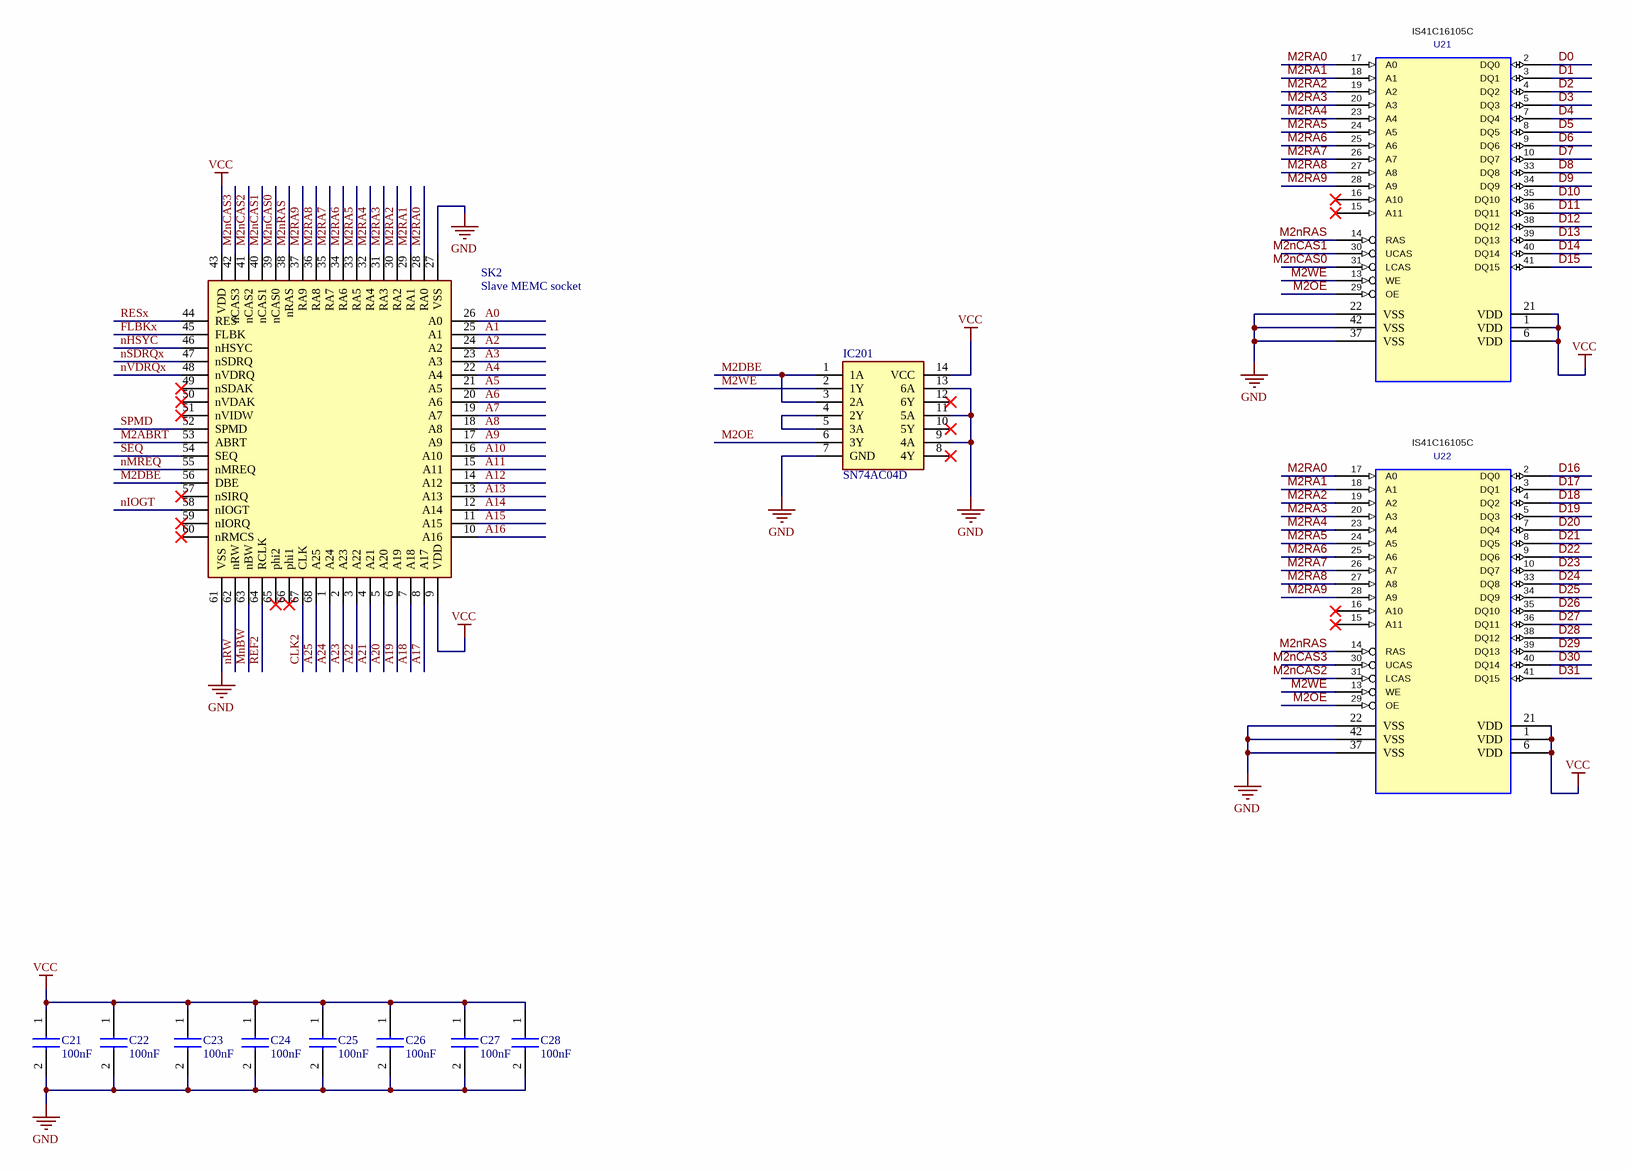
[diagram p2: A3010_Adelaide_8MB_IDE_RAM2.SchDoc]

### Parts
C21  100nF  [CAPC2012X145N]
C22  100nF  [CAPC2012X145N]
C23  100nF  [CAPC2012X145N]
C24  100nF  [CAPC2012X145N]
C25  100nF  [CAPC2012X145N]
C26  100nF  [CAPC2012X145N]
C27  100nF  [CAPC2012X145N]
C28  100nF  [CAPC2012X145N]
IC201  SN74AC04D  [SOIC127P600X175-14N]
SK2  Slave MEMC socket  [MEMC_Socket]
U21  IS41C16105C  [SOJ-42]
U22  IS41C16105C  [SOJ-42]

### Nets
GND: C21.2 C22.2 C23.2 C24.2 C25.2 C26.2 C27.2 C28.2 IC201.7(GND) IC201.9(4A) IC201.11(5A) IC201.13(6A) SK2.27(VSS) SK2.61(VSS) U21.22(VSS) U21.37(VSS) U21.42(VSS) U22.22(VSS) U22.37(VSS) U22.42(VSS)
VCC: C21.1 C22.1 C23.1 C24.1 C25.1 C26.1 C27.1 C28.1 IC201.14(VCC) SK2.9(VDD) SK2.43(VDD) U21.1(VCC) U21.6(VCC) U21.21(VCC) U22.1(VCC) U22.6(VCC) U22.21(VCC)
A0: SK2.26(A0)
A1: SK2.25(A1)
A2: SK2.24(A2)
A3: SK2.23(A3)
A4: SK2.22(A4)
A5: SK2.21(A5)
A6: SK2.20(A6)
A7: SK2.19(A7)
A8: SK2.18(A8)
A9: SK2.17(A9)
A10: SK2.16(A10)
A11: SK2.15(A11)
A12: SK2.14(A12)
A13: SK2.13(A13)
A14: SK2.12(A14)
A15: SK2.11(A15)
A16: SK2.10(A16)
A17: SK2.8(A17)
A18: SK2.7(A18)
A19: SK2.6(A19)
A20: SK2.5(A20)
A21: SK2.4(A21)
A22: SK2.3(A22)
A23: SK2.2(A23)
A24: SK2.1(A24)
A25: SK2.68(A25)
CLK2: SK2.67(CLK)
D0: U21.2(DQ0)
D1: U21.3(DQ1)
D2: U21.4(DQ2)
D3: U21.5(DQ3)
D4: U21.7(DQ4)
D5: U21.8(DQ5)
D6: U21.9(DQ6)
D7: U21.10(DQ7)
D8: U21.33(DQ8)
D9: U21.34(DQ9)
D10: U21.35(DQ10)
D11: U21.36(DQ11)
D12: U21.38(DQ12)
D13: U21.39(DQ13)
D14: U21.40(DQ14)
D15: U21.41(DQ15)
D16: U22.2(DQ0)
D17: U22.3(DQ1)
D18: U22.4(DQ2)
D19: U22.5(DQ3)
D20: U22.7(DQ4)
D21: U22.8(DQ5)
D22: U22.9(DQ6)
D23: U22.10(DQ7)
D24: U22.33(DQ8)
D25: U22.34(DQ9)
D26: U22.35(DQ10)
D27: U22.36(DQ11)
D28: U22.38(DQ12)
D29: U22.39(DQ13)
D30: U22.40(DQ14)
D31: U22.41(DQ15)
FLBKx: SK2.45(FLBK)
M2ABRT: SK2.53(ABRT)
M2DBE: IC201.1(1A) IC201.3(2A) SK2.56(DBE)
M2nCAS0: SK2.39(nCAS0) U21.31(LCAS)
M2nCAS1: SK2.40(nCAS1) U21.30(UCAS)
M2nCAS2: SK2.41(nCAS2) U22.31(LCAS)
M2nCAS3: SK2.42(nCAS3) U22.30(UCAS)
M2nRAS: SK2.38(nRAS) U21.14(RAS) U22.14(RAS)
M2OE: IC201.6(3Y) U21.29(OE) U22.29(OE)
M2RA0: SK2.28(RA0) U21.17(A0) U22.17(A0)
M2RA1: SK2.29(RA1) U21.18(A1) U22.18(A1)
M2RA2: SK2.30(RA2) U21.19(A2) U22.19(A2)
M2RA3: SK2.31(RA3) U21.20(A3) U22.20(A3)
M2RA4: SK2.32(RA4) U21.23(A4) U22.23(A4)
M2RA5: SK2.33(RA5) U21.24(A5) U22.24(A5)
M2RA6: SK2.34(RA6) U21.25(A6) U22.25(A6)
M2RA7: SK2.35(RA7) U21.26(A7) U22.26(A7)
M2RA8: SK2.36(RA8) U21.27(A8) U22.27(A8)
M2RA9: SK2.37(RA9) U21.28(A9) U22.28(A9)
M2WE: IC201.2(1Y) U21.13(WE) U22.13(WE)
MnBW: SK2.63(nBW)
nHSYC: SK2.46(nHSYC)
nIOGT: SK2.58(nIOGT)
nMREQ: SK2.55(nMREQ)
nRW: SK2.62(nRW)
nSDRQx: SK2.47(nSDRQ)
nVDRQx: SK2.48(nVDRQ)
REF2: SK2.64(RCLK)
RESx: SK2.44(RES)
SEQ: SK2.54(SEQ)
SPMD: SK2.52(SPMD)
NetIC201_4: IC201.4(2Y) IC201.5(3A)

Not connected (* = marked no-connect by the designer): IC201 8(4Y)* 10(5Y)* 12(6Y)*; SK2 49(nSDAK)* 50(nVDAK)* 51(nVIDW)* 57(nSIRQ)* 59(nIORQ)* 60(nRMCS)* 65(phi2)* 66(phi1)*; U21 15(A11)* 16(A10)*; U22 15(A11)* 16(A10)*

### Notes on the sheet
- SIZE
- CODION LTD
- DIMENSIONS
- TITLE
- VARIANT
- REVISION
- DATE
- A3
- SHEET
- OF
- FILE
- DRAWN BY

### Library data of the parts
C21-C28 = C2012X7R1H104K125AM: Capacitor; Manufacturer_Name: TDK; Datasheet Link: https://product.tdk.com/info/en/catalog/datasheets/mlcc_commercial_midvoltage_en.pdf; Height: 1.45mm; Manufacturer_Part_Number: C2012X7R1H104K125AM; Mouser Part Number: 810-C2012X7R1H104KT5; Mouser Price/Stock: https://www.mouser.com/Search/Refine.aspx?Keyword=810-C2012X7R1H104KT5; Arrow Part Number: C2012X7R1H104K125AM; Arrow Price/Stock: https://www.arrow.com/en/products/c2012x7r1h104k125am/tdk
IC201 = SN74AC04D: as IC102 on sheet A3010_Adelaide_8MB_IDE_RAM; Datasheet Link: http://www.ti.com/lit/ds/symlink/sn74ac04.pdf; Height: 1.75mm; Manufacturer_Part_Number: SN74AC04D; Mouser Part Number: 595-SN74AC04D; Mouser Price/Stock: https://www.mouser.co.uk/ProductDetail/Texas-Instruments/SN74AC04D?qs=w32V8uFkMxkvsyMHHacuZw%3D%3D; Arrow Part Number: SN74AC04D; Arrow Price/Stock: https://www.arrow.com/en/products/sn74ac04d/texas-instruments?region=nac
SK2 = MEMC_Skt: as SK101 on sheet A3010_Adelaide_8MB_IDE_RAM; Datasheet Link: https://www.arrow.com/en/products/8468-21b1-rk-tr/3m; Height: 4.6mm; Mouser Part Number: 517-8468-21B1-RK-TR; Mouser Price/Stock: https://www.mouser.co.uk/ProductDetail/3M-Electronic-Solutions-Division/8468-21B1-RK-TR?qs=X%2F%2F06fXhnJ18zOj3KK47CQ%3D%3D; Arrow Part Number: 8468-21B1-RK-TR; Arrow Price/Stock: https://www.arrow.com/en/products/8468-21b1-rk-tr/3m
U21 U22 = DRAM_1MX16_SOJ: Value: IS41C16105C

## Nets that join several sheets
GND: A3010_Adelaide_8MB_IDE (24 pins), A3010_Adelaide_8MB_IDE_RAM (30 pins), A3010_Adelaide_8MB_IDE_RAM2 (20 pins)
VCC: A3010_Adelaide_8MB_IDE (15 pins), A3010_Adelaide_8MB_IDE_RAM (21 pins), A3010_Adelaide_8MB_IDE_RAM2 (17 pins)
A0: A3010_Adelaide_8MB_IDE_RAM (J101.2 SK101.26), A3010_Adelaide_8MB_IDE_RAM2 (SK2.26)
A1: A3010_Adelaide_8MB_IDE_RAM (J101.4 SK101.25), A3010_Adelaide_8MB_IDE_RAM2 (SK2.25)
A2: A3010_Adelaide_8MB_IDE_RAM (J101.6 SK101.24), A3010_Adelaide_8MB_IDE_RAM2 (SK2.24)
A3: A3010_Adelaide_8MB_IDE_RAM (J101.8 SK101.23), A3010_Adelaide_8MB_IDE_RAM2 (SK2.23)
A4: A3010_Adelaide_8MB_IDE_RAM (J101.10 SK101.22), A3010_Adelaide_8MB_IDE_RAM2 (SK2.22)
A5: A3010_Adelaide_8MB_IDE_RAM (J101.12 SK101.21), A3010_Adelaide_8MB_IDE_RAM2 (SK2.21)
A6: A3010_Adelaide_8MB_IDE_RAM (J101.14 SK101.20), A3010_Adelaide_8MB_IDE_RAM2 (SK2.20)
A7: A3010_Adelaide_8MB_IDE_RAM (J101.16 SK101.19), A3010_Adelaide_8MB_IDE_RAM2 (SK2.19)
A8: A3010_Adelaide_8MB_IDE_RAM (J101.18 SK101.18), A3010_Adelaide_8MB_IDE_RAM2 (SK2.18)
A9: A3010_Adelaide_8MB_IDE_RAM (J101.20 SK101.17), A3010_Adelaide_8MB_IDE_RAM2 (SK2.17)
A10: A3010_Adelaide_8MB_IDE_RAM (J101.22 SK101.16), A3010_Adelaide_8MB_IDE_RAM2 (SK2.16)
A11: A3010_Adelaide_8MB_IDE_RAM (J101.24 SK101.15), A3010_Adelaide_8MB_IDE_RAM2 (SK2.15)
A12: A3010_Adelaide_8MB_IDE_RAM (J101.26 SK101.14), A3010_Adelaide_8MB_IDE_RAM2 (SK2.14)
A13: A3010_Adelaide_8MB_IDE_RAM (J101.28 SK101.13), A3010_Adelaide_8MB_IDE_RAM2 (SK2.13)
A14: A3010_Adelaide_8MB_IDE_RAM (J101.30 SK101.12), A3010_Adelaide_8MB_IDE_RAM2 (SK2.12)
A15: A3010_Adelaide_8MB_IDE_RAM (J101.32 SK101.11), A3010_Adelaide_8MB_IDE_RAM2 (SK2.11)
A16: A3010_Adelaide_8MB_IDE_RAM (J101.34 SK101.10), A3010_Adelaide_8MB_IDE_RAM2 (SK2.10)
A17: A3010_Adelaide_8MB_IDE_RAM (J101.36 SK101.8), A3010_Adelaide_8MB_IDE_RAM2 (SK2.8)
A18: A3010_Adelaide_8MB_IDE_RAM (J101.38 SK101.7), A3010_Adelaide_8MB_IDE_RAM2 (SK2.7)
A19: A3010_Adelaide_8MB_IDE_RAM (J101.40 SK101.6), A3010_Adelaide_8MB_IDE_RAM2 (SK2.6)
A20: A3010_Adelaide_8MB_IDE_RAM (J101.42 SK101.5), A3010_Adelaide_8MB_IDE_RAM2 (SK2.5)
A21: A3010_Adelaide_8MB_IDE_RAM (J101.44 SK101.4), A3010_Adelaide_8MB_IDE_RAM2 (SK2.4)
A22: A3010_Adelaide_8MB_IDE_RAM (J101.46 SK101.3), A3010_Adelaide_8MB_IDE_RAM2 (SK2.3)
A23: A3010_Adelaide_8MB_IDE_RAM (J101.48 SK101.2), A3010_Adelaide_8MB_IDE_RAM2 (SK2.2)
A24: A3010_Adelaide_8MB_IDE_RAM (J101.50 SK101.1), A3010_Adelaide_8MB_IDE_RAM2 (SK2.1)
A25: A3010_Adelaide_8MB_IDE_RAM (J101.52 SK101.68), A3010_Adelaide_8MB_IDE_RAM2 (SK2.68)
CLK2: A3010_Adelaide_8MB_IDE_RAM (U4.16), A3010_Adelaide_8MB_IDE_RAM2 (SK2.67)
D0: A3010_Adelaide_8MB_IDE (IC1-ROM1.14 J5.8), A3010_Adelaide_8MB_IDE_RAM (U101.2), A3010_Adelaide_8MB_IDE_RAM2 (U21.2)
D1: A3010_Adelaide_8MB_IDE (IC1-ROM1.16 J5.6), A3010_Adelaide_8MB_IDE_RAM (U101.3), A3010_Adelaide_8MB_IDE_RAM2 (U21.3)
D2: A3010_Adelaide_8MB_IDE (IC1-ROM1.18 J5.4), A3010_Adelaide_8MB_IDE_RAM (U101.4), A3010_Adelaide_8MB_IDE_RAM2 (U21.4)
D3: A3010_Adelaide_8MB_IDE (IC1-ROM1.20 J5.2), A3010_Adelaide_8MB_IDE_RAM (U101.5), A3010_Adelaide_8MB_IDE_RAM2 (U21.5)
D4: A3010_Adelaide_8MB_IDE (IC1-ROM1.23 J6.20), A3010_Adelaide_8MB_IDE_RAM (U101.7), A3010_Adelaide_8MB_IDE_RAM2 (U21.7)
D5: A3010_Adelaide_8MB_IDE (IC1-ROM1.25 J6.18), A3010_Adelaide_8MB_IDE_RAM (U101.8), A3010_Adelaide_8MB_IDE_RAM2 (U21.8)
D6: A3010_Adelaide_8MB_IDE (IC1-ROM1.27 J6.16), A3010_Adelaide_8MB_IDE_RAM (U101.9), A3010_Adelaide_8MB_IDE_RAM2 (U21.9)
D7: A3010_Adelaide_8MB_IDE (IC1-ROM1.29 J6.14), A3010_Adelaide_8MB_IDE_RAM (U101.10), A3010_Adelaide_8MB_IDE_RAM2 (U21.10)
D8: A3010_Adelaide_8MB_IDE (IC1-ROM1.15 J5.7 RN2.5), A3010_Adelaide_8MB_IDE_RAM (U101.33), A3010_Adelaide_8MB_IDE_RAM2 (U21.33)
D9: A3010_Adelaide_8MB_IDE (IC1-ROM1.17 J5.5 RN2.6), A3010_Adelaide_8MB_IDE_RAM (U101.34), A3010_Adelaide_8MB_IDE_RAM2 (U21.34)
D10: A3010_Adelaide_8MB_IDE (IC1-ROM1.19 J5.3 RN2.7), A3010_Adelaide_8MB_IDE_RAM (U101.35), A3010_Adelaide_8MB_IDE_RAM2 (U21.35)
D11: A3010_Adelaide_8MB_IDE (IC1-ROM1.21 J5.1 RN2.8), A3010_Adelaide_8MB_IDE_RAM (U101.36), A3010_Adelaide_8MB_IDE_RAM2 (U21.36)
D12: A3010_Adelaide_8MB_IDE (IC1-ROM1.24 J6.19 RN1.5), A3010_Adelaide_8MB_IDE_RAM (U101.38), A3010_Adelaide_8MB_IDE_RAM2 (U21.38)
D13: A3010_Adelaide_8MB_IDE (IC1-ROM1.26 J6.17 RN1.6), A3010_Adelaide_8MB_IDE_RAM (U101.39), A3010_Adelaide_8MB_IDE_RAM2 (U21.39)
D14: A3010_Adelaide_8MB_IDE (IC1-ROM1.28 J6.15 RN1.7), A3010_Adelaide_8MB_IDE_RAM (U101.40), A3010_Adelaide_8MB_IDE_RAM2 (U21.40)
D15: A3010_Adelaide_8MB_IDE (IC1-ROM1.30 J6.13 RN1.8), A3010_Adelaide_8MB_IDE_RAM (U101.41), A3010_Adelaide_8MB_IDE_RAM2 (U21.41)
D16: A3010_Adelaide_8MB_IDE (IC2-ROM2.14 J7.8), A3010_Adelaide_8MB_IDE_RAM (U102.2), A3010_Adelaide_8MB_IDE_RAM2 (U22.2)
D17: A3010_Adelaide_8MB_IDE (IC2-ROM2.16 J7.6), A3010_Adelaide_8MB_IDE_RAM (U102.3), A3010_Adelaide_8MB_IDE_RAM2 (U22.3)
D18: A3010_Adelaide_8MB_IDE (IC2-ROM2.18 J7.4), A3010_Adelaide_8MB_IDE_RAM (U102.4), A3010_Adelaide_8MB_IDE_RAM2 (U22.4)
D19: A3010_Adelaide_8MB_IDE (IC2-ROM2.20 J7.2), A3010_Adelaide_8MB_IDE_RAM (U102.5), A3010_Adelaide_8MB_IDE_RAM2 (U22.5)
D20: A3010_Adelaide_8MB_IDE_RAM (U102.7), A3010_Adelaide_8MB_IDE_RAM2 (U22.7)
D21: A3010_Adelaide_8MB_IDE_RAM (U102.8), A3010_Adelaide_8MB_IDE_RAM2 (U22.8)
D22: A3010_Adelaide_8MB_IDE_RAM (U102.9), A3010_Adelaide_8MB_IDE_RAM2 (U22.9)
D23: A3010_Adelaide_8MB_IDE (IC2-ROM2.23 J8.20), A3010_Adelaide_8MB_IDE_RAM (U102.10), A3010_Adelaide_8MB_IDE_RAM2 (U22.10)
D24: A3010_Adelaide_8MB_IDE (5 pins), A3010_Adelaide_8MB_IDE_RAM (U102.33), A3010_Adelaide_8MB_IDE_RAM2 (U22.33)
D25: A3010_Adelaide_8MB_IDE (5 pins), A3010_Adelaide_8MB_IDE_RAM (U102.34), A3010_Adelaide_8MB_IDE_RAM2 (U22.34)
D26: A3010_Adelaide_8MB_IDE (5 pins), A3010_Adelaide_8MB_IDE_RAM (U102.35), A3010_Adelaide_8MB_IDE_RAM2 (U22.35)
D27: A3010_Adelaide_8MB_IDE (IC2-ROM2.21 IC3.6 J7.1), A3010_Adelaide_8MB_IDE_RAM (U102.36), A3010_Adelaide_8MB_IDE_RAM2 (U22.36)
D28: A3010_Adelaide_8MB_IDE (IC2-ROM2.24 IC3.5 J8.19), A3010_Adelaide_8MB_IDE_RAM (U102.38), A3010_Adelaide_8MB_IDE_RAM2 (U22.38)
D29: A3010_Adelaide_8MB_IDE (IC2-ROM2.26 IC3.4 J8.17), A3010_Adelaide_8MB_IDE_RAM (U102.39), A3010_Adelaide_8MB_IDE_RAM2 (U22.39)
D30: A3010_Adelaide_8MB_IDE (IC2-ROM2.28 IC3.3 J8.15), A3010_Adelaide_8MB_IDE_RAM (U102.40), A3010_Adelaide_8MB_IDE_RAM2 (U22.40)
D31: A3010_Adelaide_8MB_IDE (IC2-ROM2.30 IC3.2 J8.13), A3010_Adelaide_8MB_IDE_RAM (U102.41), A3010_Adelaide_8MB_IDE_RAM2 (U22.41)
FLBKx: A3010_Adelaide_8MB_IDE_RAM (SK101.45 U5.16), A3010_Adelaide_8MB_IDE_RAM2 (SK2.45)
M2ABRT: A3010_Adelaide_8MB_IDE_RAM (U5.6), A3010_Adelaide_8MB_IDE_RAM2 (SK2.53)
M2nRAS: A3010_Adelaide_8MB_IDE_RAM (U5.8), A3010_Adelaide_8MB_IDE_RAM2 (SK2.38 U21.14 U22.14)
MnBW: A3010_Adelaide_8MB_IDE_RAM (U5.12), A3010_Adelaide_8MB_IDE_RAM2 (SK2.63)
nHSYC: A3010_Adelaide_8MB_IDE_RAM (J101.9 SK101.46), A3010_Adelaide_8MB_IDE_RAM2 (SK2.46)
nIOGT: A3010_Adelaide_8MB_IDE_RAM (J101.33 SK101.58), A3010_Adelaide_8MB_IDE_RAM2 (SK2.58)
nMREQ: A3010_Adelaide_8MB_IDE_RAM (J101.27 SK101.55), A3010_Adelaide_8MB_IDE_RAM2 (SK2.55)
nRW: A3010_Adelaide_8MB_IDE_RAM (J101.41 SK101.62), A3010_Adelaide_8MB_IDE_RAM2 (SK2.62)
nSDRQx: A3010_Adelaide_8MB_IDE_RAM (SK101.47 U5.17), A3010_Adelaide_8MB_IDE_RAM2 (SK2.47)
nVDRQx: A3010_Adelaide_8MB_IDE_RAM (SK101.48 U5.18), A3010_Adelaide_8MB_IDE_RAM2 (SK2.48)
REF2: A3010_Adelaide_8MB_IDE_RAM (U4.2), A3010_Adelaide_8MB_IDE_RAM2 (SK2.64)
RESx: A3010_Adelaide_8MB_IDE_RAM (SK101.44 U5.15), A3010_Adelaide_8MB_IDE_RAM2 (SK2.44)
SEQ: A3010_Adelaide_8MB_IDE_RAM (J101.25 SK101.54), A3010_Adelaide_8MB_IDE_RAM2 (SK2.54)
SPMD: A3010_Adelaide_8MB_IDE_RAM (J101.21 SK101.52), A3010_Adelaide_8MB_IDE_RAM2 (SK2.52)

## Assembly variants
STD: not fitted J1 J2 J3 J4